# EAGLE schematic fretscanner4 (EAGLE 6.6.0)
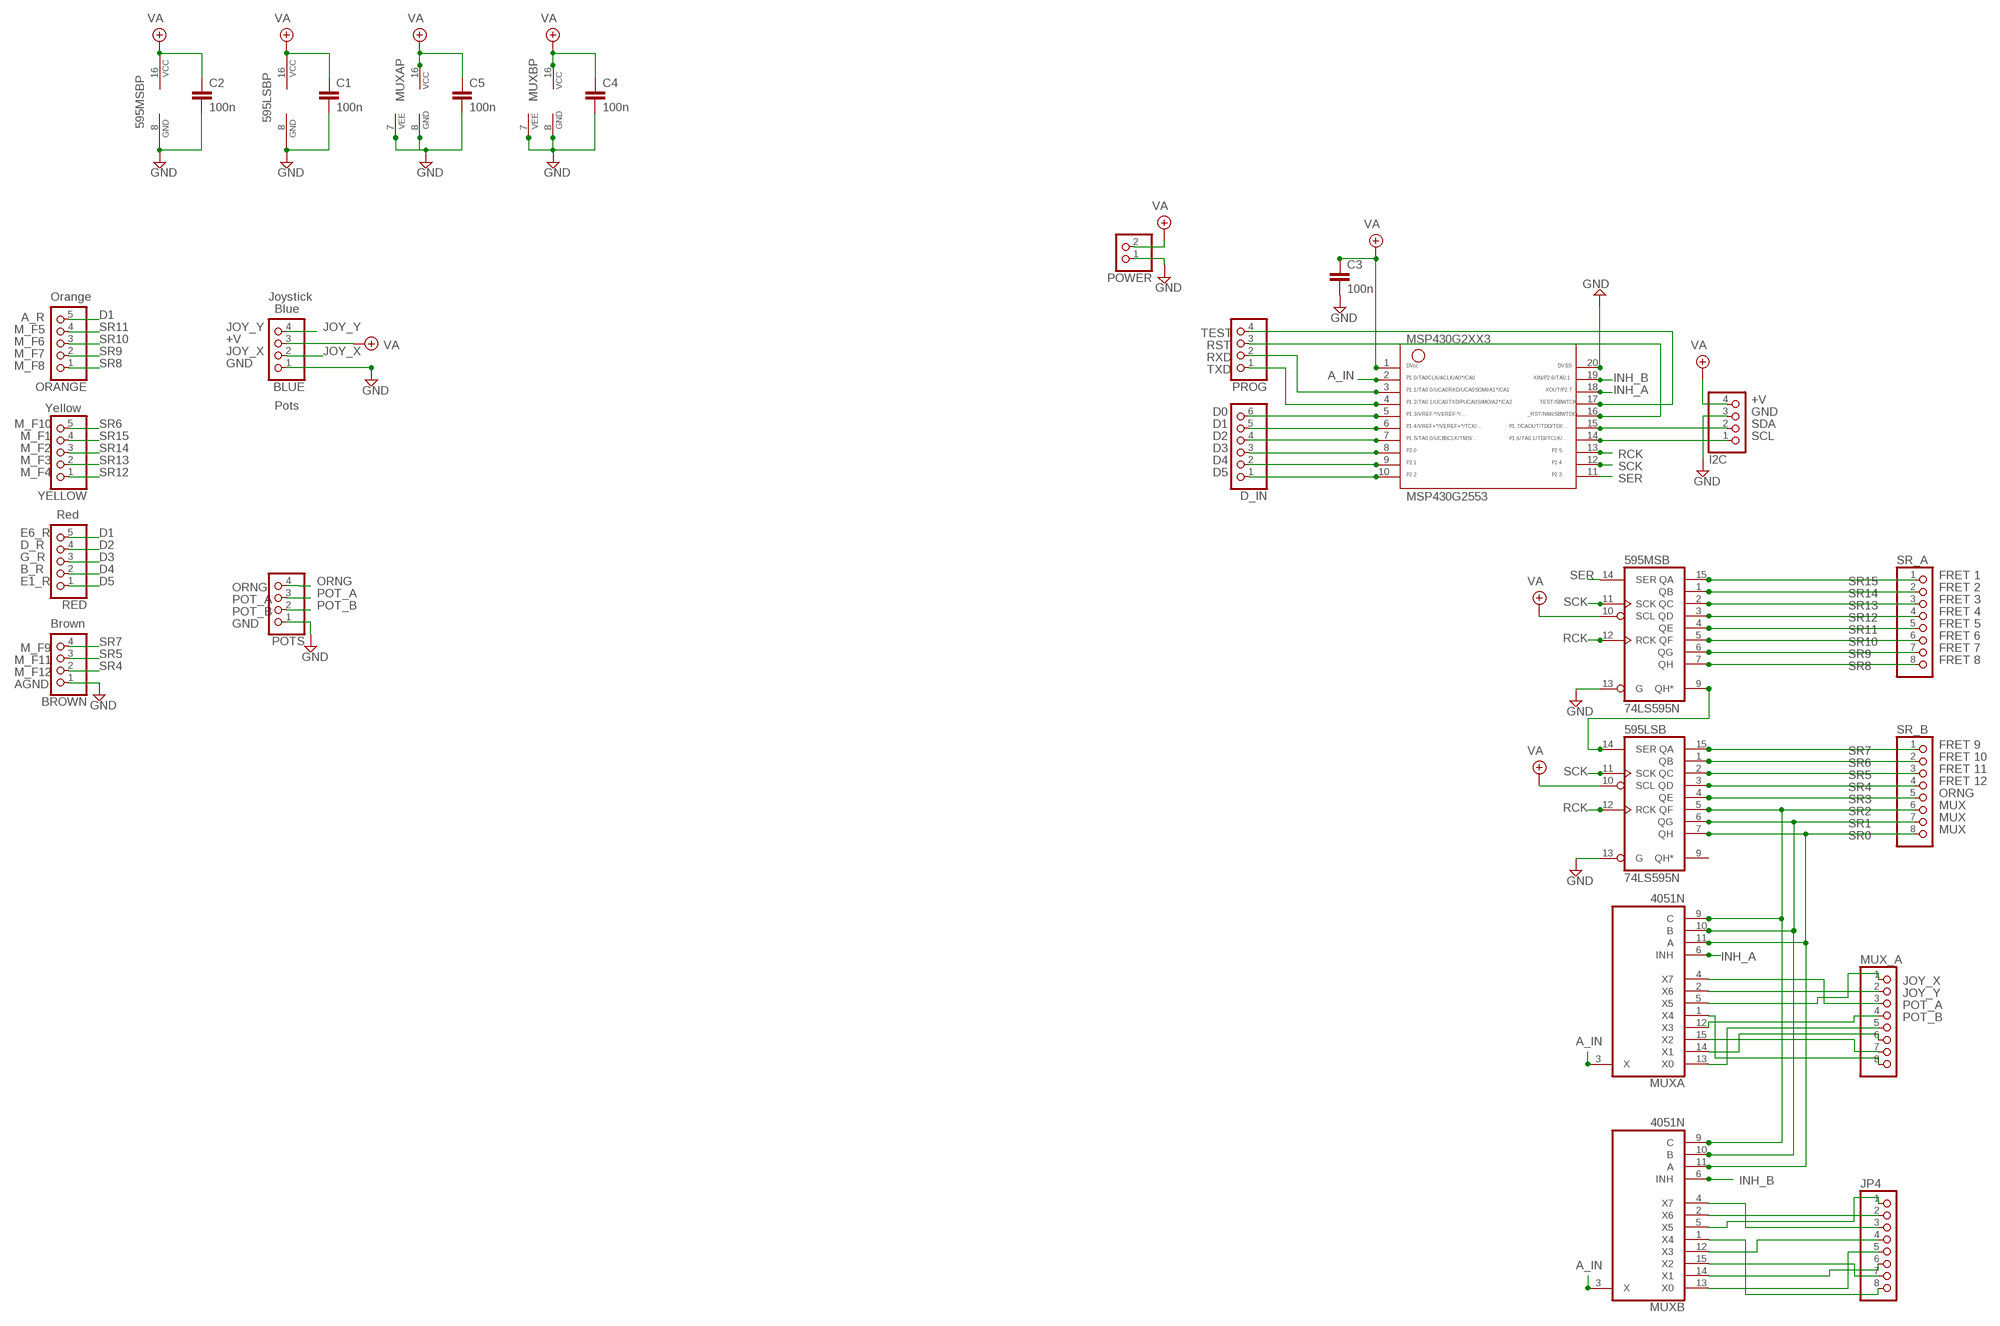
[diagram p0: schematic, sheet 1]

## Parts
595LSB  74LS595N  [DIL16]
595MSB  74LS595N  [DIL16]
BLUE  PINHD-1X4  [1X04]
BROWN  PINHD-1X4  [1X04]
C1  100n  050X030_050  [050X030_050_3]
C2  100n  050X030_050  [050X030_050_3]
C3  100n  050X030_050  [050X030_050_3]
C4  100n  050X030_050  [050X030_050_3]
C5  100n  050X030_050  [050X030_050_3]
D_IN  PINHD-1X6  [1X06]
I2C  PINHD-1X4  [1X04]
JP4  PINHD-1X8  [1X08]
MSP430G2553  G2XX3---N20  [N20]
MUX_A  PINHD-1X8  [1X08]
MUXA  4051N  [DIL16]
MUXB  4051N  [DIL16]
ORANGE  PINHD-1X5  [1X05]
POTS  PINHD-1X4  [1X04]
POWER  PINHD-1X2  [1X02]
PROG  PINHD-1X4  [1X04]
RED  PINHD-1X5  [1X05]
SR_A  PINHD-1X8  [1X08]
SR_B  PINHD-1X8  [1X08]
YELLOW  PINHD-1X5  [1X05]

## Nets
_RST: MSP430G2553.16 PROG.3
A_IN: MSP430G2553.2 MUXA.3(X) MUXB.3(X)
D0: D_IN.6 MSP430G2553.5
D1: D_IN.5 MSP430G2553.6 ORANGE.5 RED.5
D2: D_IN.4 MSP430G2553.7 RED.4
D3: D_IN.3 MSP430G2553.8 RED.3
D4: D_IN.2 MSP430G2553.9 RED.2
D5: D_IN.1 MSP430G2553.10 RED.1
GND: 595LSB.8(GND) 595LSB.13(G) 595MSB.8(GND) 595MSB.13(G) BLUE.1 BROWN.1 C1.2 C2.2 C3.2 C4.2 C5.2 I2C.3 MSP430G2553.20 MUXA.7(VEE) MUXA.8(GND) MUXB.7(VEE) MUXB.8(GND) POTS.1 POWER.1
INH_A: MSP430G2553.18 MUXA.6(INH)
INH_B: MSP430G2553.19 MUXB.6(INH)
JOY_X: BLUE.2 MUX_A.1 MUXA.5(X5)
JOY_Y: BLUE.4 MUX_A.2 MUXA.2(X6)
N$1: 595LSB.14(SER) 595MSB.9(QH*)
N$2: MUX_A.7 MUXA.15(X2)
N$3: MUX_A.6 MUXA.14(X1)
N$4: MUX_A.5 MUXA.13(X0)
N$6: JP4.3 MUXB.4(X7)
N$7: JP4.2 MUXB.2(X6)
N$9: JP4.1 MUXB.5(X5)
N$10: JP4.8 MUXB.1(X4)
N$11: JP4.4 MUXB.12(X3)
N$12: JP4.7 MUXB.15(X2)
N$13: MUX_A.8 MUXA.1(X4)
N$14: JP4.6 MUXB.14(X1)
N$17: JP4.5 MUXB.13(X0)
ORNG: POTS.4
POT_A: MUX_A.3 MUXA.4(X7) POTS.3
POT_B: MUX_A.4 MUXA.12(X3) POTS.2
RCK: 595LSB.12(RCK) 595MSB.12(RCK) MSP430G2553.13
RXD: MSP430G2553.3 PROG.2
SCK: 595LSB.11(SCK) 595MSB.11(SCK) MSP430G2553.12
SCL: I2C.1 MSP430G2553.14
SDA: I2C.2 MSP430G2553.15
SER: 595MSB.14(SER) MSP430G2553.11
SR0: 595LSB.7(QH) MUXA.11(A) MUXB.11(A) SR_B.8
SR1: 595LSB.6(QG) MUXA.10(B) MUXB.10(B) SR_B.7
SR2: 595LSB.5(QF) MUXA.9(C) MUXB.9(C) SR_B.6
SR3: 595LSB.4(QE) SR_B.5
SR4: 595LSB.3(QD) BROWN.2 SR_B.4
SR5: 595LSB.2(QC) BROWN.3 SR_B.3
SR6: 595LSB.1(QB) SR_B.2 YELLOW.5
SR7: 595LSB.15(QA) BROWN.4 SR_B.1
SR8: 595MSB.7(QH) ORANGE.1 SR_A.8
SR9: 595MSB.6(QG) ORANGE.2 SR_A.7
SR10: 595MSB.5(QF) ORANGE.3 SR_A.6
SR11: 595MSB.4(QE) ORANGE.4 SR_A.5
SR12: 595MSB.3(QD) SR_A.4 YELLOW.1
SR13: 595MSB.2(QC) SR_A.3 YELLOW.2
SR14: 595MSB.1(QB) SR_A.2 YELLOW.3
SR15: 595MSB.15(QA) SR_A.1 YELLOW.4
TEST: MSP430G2553.17 PROG.4
TXD: MSP430G2553.4 PROG.1
VA: 595LSB.10(SCL) 595LSB.16(VCC) 595MSB.10(SCL) 595MSB.16(VCC) BLUE.3 C1.1 C2.1 C3.1 C4.1 C5.1 I2C.4 MSP430G2553.1 MUXA.16(VCC) MUXB.16(VCC) POWER.2
Unconnected: 595LSB.9(QH*)

## Notes on the sheet
- Orange | Joystick
- A_R | Blue
- M_F5
- JOY_Y
- M_F6 | TEST
- +V
- M_F7 | RST
- JOY_X
- M_F8 | RXD
- GND
- TXD
- Yellow | +V
- Pots
- GND
- M_F10 | SDA
- M_F1 | SCL
- M_F2
- M_F3
- M_F4
- Red
- E6_R
- D_R
- G_R
- B_R
- FRET 1
- E1_R
- ORNG | FRET 2
- POT_A | FRET 3
- POT_B | FRET 4
- Brown | GND | FRET 5
- FRET 6
- M_F9 | FRET 7
- M_F11 | FRET 8
- M_F12
- AGND
- FRET 9
- FRET 10
- FRET 11
- FRET 12
- ORNG
- MUX
- MUX
- MUX

## Library data of the parts
595LSB 595MSB = 74xx-us:74*595: 8-bit SHIFT REGISTER, output latch
BLUE BROWN I2C POTS PROG = pinhead:PINHD-1X4: PIN HEADER
C1-C5 = gm-caps-ceramic:050X030_050: 120 - 150pF Xicon Ceramic Disc 5mm lead spacing
D_IN = pinhead:PINHD-1X6: PIN HEADER
JP4 MUX_A SR_A SR_B = pinhead:PINHD-1X8: PIN HEADER
MSP430G2553 = TI_MSP430_v16:G2XX3---N20: MSP430G2XX1 PDIP (N) 20 Pin Package
MUXA MUXB = 40xx:4051: 8-channel ANALOG MULTIPLEXER
ORANGE RED YELLOW = pinhead:PINHD-1X5: PIN HEADER
POWER = pinhead:PINHD-1X2: PIN HEADER